# EasyEDA schematic Mix_schematic.json
TITLE: Sheet_1; REV: 1.0; Date: 2021-06-11; Sheet: 1/1; Drawn By: Stefan; Company: Your Company
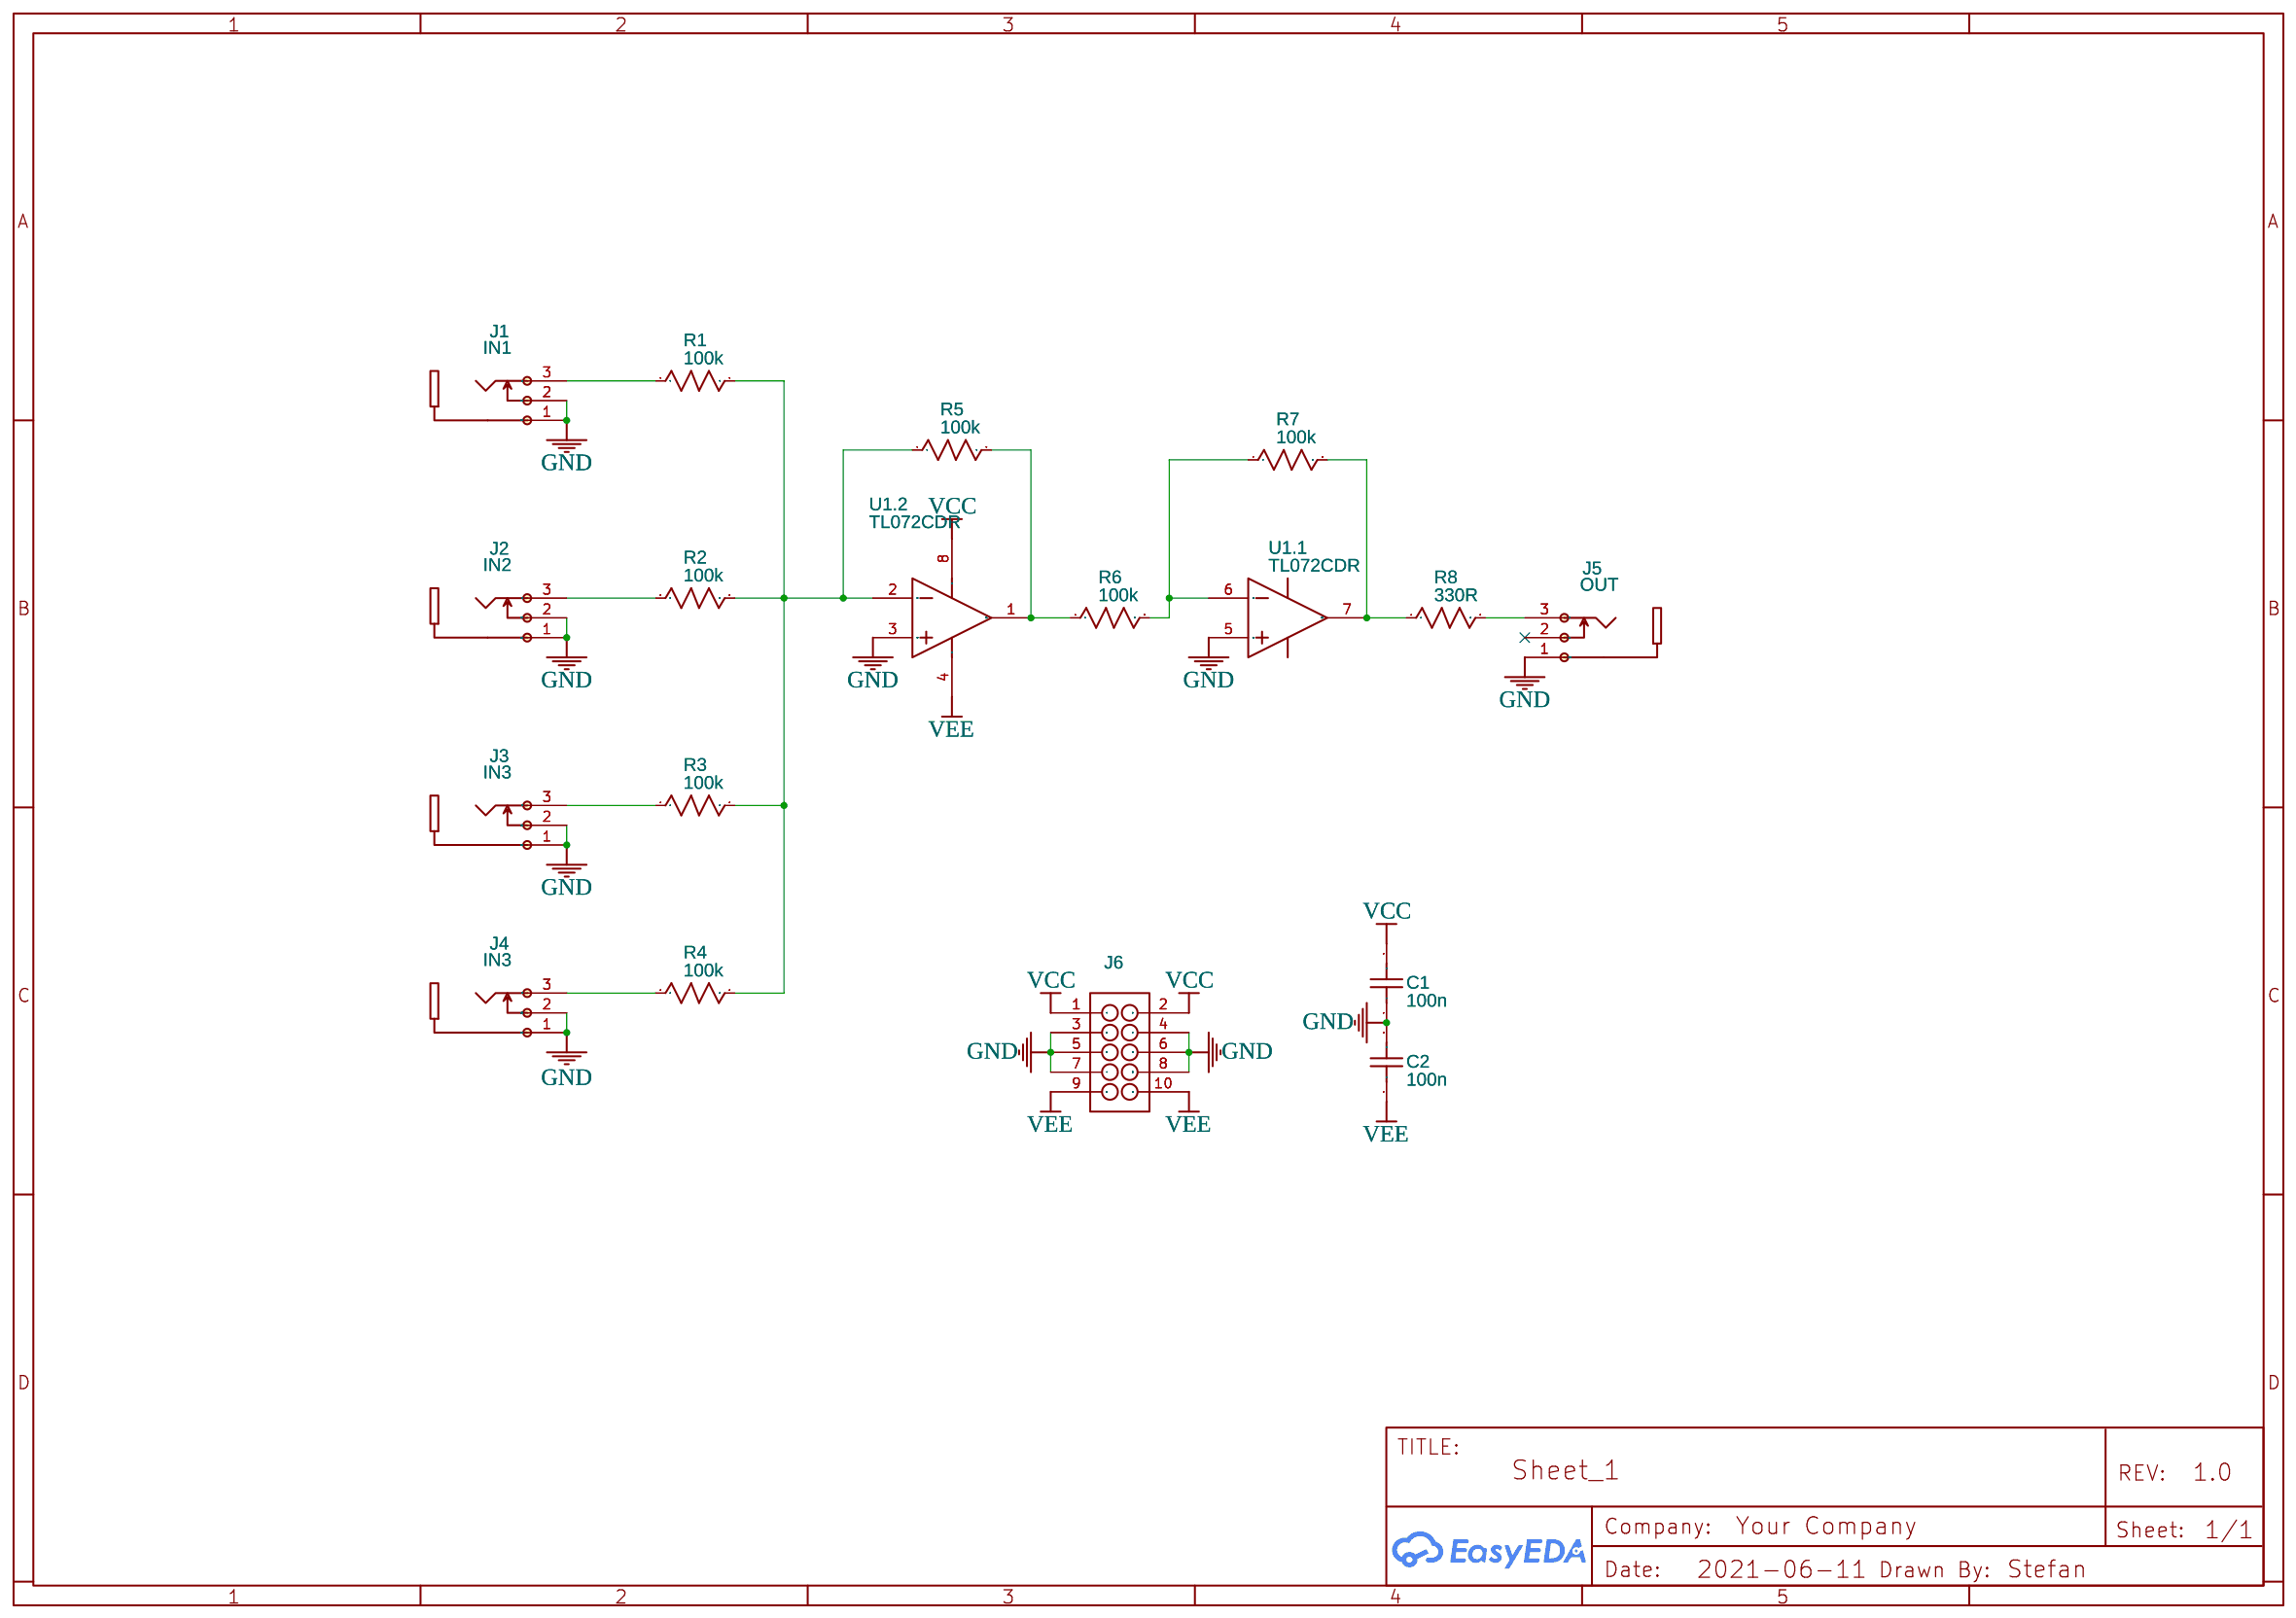
[diagram p0: schematic sheet]

## Parts
C1  100n  [C0805]
C2  100n  [C0805]
J1  IN1  [THONKICONN]
J2  IN2  [THONKICONN]
J3  IN3  [THONKICONN]
J4  IN3  [THONKICONN]
J5  OUT  [THONKICONN]
J6  Shrouded Header 2X05 PTH  [PINSHRD_PTH_2X05B]
R1  100k  [R0805]
R2  100k  [R0805]
R3  100k  [R0805]
R4  100k  [R0805]
R5  100k  [R0805]
R6  100k  [R0805]
R7  100k  [R0805]
R8  330R  [R0805]
U1  TL072CDR  [SOIC-8_L5.3-W5.3-P1.27-LS8.0-BL]  (sections 1,2)

## Library data of the parts
C1 C2 = C_RAD-0.1_US: Contributor: LCEDA_Lib
J1-J5 = Thonkiconn: Manufacturer Part: Thonk; Contributor: Stefan
J6 = Shrouded Header 2X05 PTH: 2x05 pin header; Contributor: danagould
R1-R8 = R_AXIAL-0.3_US: Contributor: LCEDA_Lib
U1 = TL072CDR: Supplier Part: C67473; Supplier: LCSC; Manufacturer: TI; subpart_no: 1

## Nets
GND: C1.1 C2.2 J1.1(SLEVE/GND) J1.2(SWITCH) J2.1(SLEVE/GND) J2.2(SWITCH) J3.1(SLEVE/GND) J3.2(SWITCH) J4.1(SLEVE/GND) J4.2(SWITCH) J5.1(SLEVE/GND) J6.3 J6.4 J6.5 J6.6 J6.7 J6.8 U1.3(IN2+) U1.5(IN2+)
VCC: C1.2 J6.1 J6.2 U1.8(VCC+)
VEE: C2.1 J6.9 J6.10 U1.4(VCC-)
Net-(J1-3): J1.3(TIP) R1.1
Net-(J2-3): J2.3(TIP) R2.1
Net-(J3-3): J3.3(TIP) R3.1
Net-(J4-3): J4.3(TIP) R4.1
Net-(J5-3): J5.3(TIP) R8.2
Net-(R1-2): R1.2 R2.2 R3.2 R4.2 R5.1 U1.2(IN2-)
Net-(R5-2): R5.2 R6.1 U1.1(OUT2)
Net-(R6-2): R6.2 R7.1 U1.6(IN2-)
Net-(R7-2): R7.2 R8.1 U1.7(OUT2)

Not connected (* = marked no-connect by the designer): J5 2(SWITCH)*
